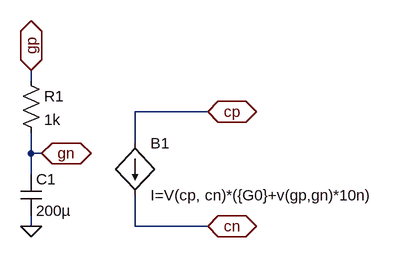
[diagram p0: schematic Capteur_Gaz.asc]
Capteur_Gaz.asc, the LTspice schematic file:
Version 4
SHEET 1 880 680
WIRE -48 0 -48 -16
WIRE 224 48 112 48
WIRE 112 96 112 48
WIRE -48 112 -48 80
WIRE -32 112 -48 112
WIRE -48 144 -48 112
WIRE -48 224 -48 208
WIRE 112 224 112 176
WIRE 224 224 112 224
FLAG 224 48 cp
IOPIN 224 48 BiDir
FLAG 224 224 cn
IOPIN 224 224 BiDir
FLAG -48 224 0
FLAG -48 -16 gp
IOPIN -48 -16 BiDir
FLAG -32 112 gn
IOPIN -32 112 BiDir
SYMBOL bi 112 96 R0
SYMATTR InstName B1
SYMATTR Value I=V(cp, cn)*({G0}+v(gp,gn)*10n)
SYMBOL res -64 -16 R0
SYMATTR InstName R1
SYMATTR Value 1k
SYMBOL cap -64 144 R0
SYMATTR InstName C1
SYMATTR Value 200µ

The netlist it stands for:
* Capteur_Gaz.asc
B1 cp cn I=V(cp, cn)*({G0}+v(gp,gn)*10n)
R1 gp gn 1k
C1 gn 0 200µ
.backanno
.end